# EAGLE schematic psu (EAGLE 9.6.2)
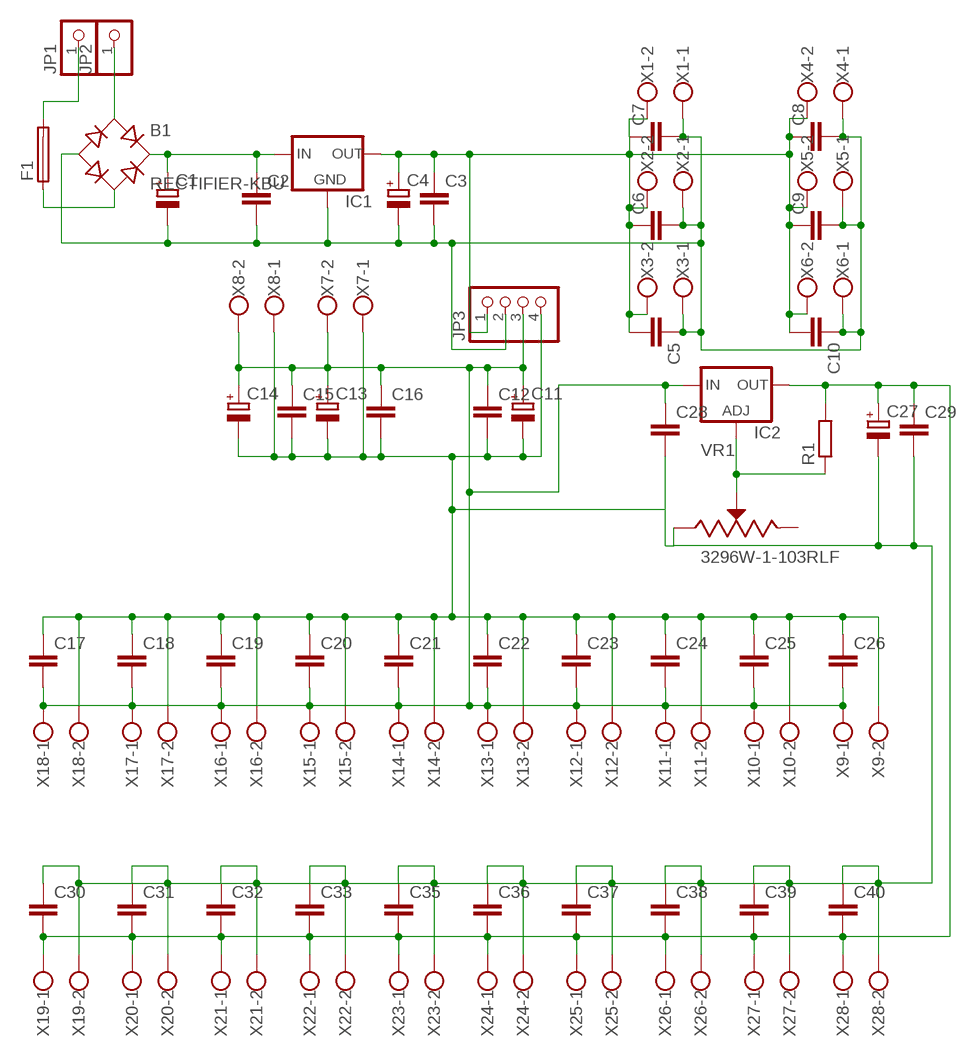
[diagram p0: schematic, sheet 1]

## Parts
B1  RECTIFIER-KBU  [KBU]
C1  CPOL-EUE7.5-18  [E7,5-18]
C2  C-EU025-025X050  [C025-025X050]
C3  C-EU025-025X050  [C025-025X050]
C4  CPOL-EUE5-10.5  [E5-10,5]
C5  C-EU025-025X050  [C025-025X050]
C6  C-EU025-025X050  [C025-025X050]
C7  C-EU025-025X050  [C025-025X050]
C8  C-EU025-025X050  [C025-025X050]
C9  C-EU025-025X050  [C025-025X050]
C10  C-EU025-025X050  [C025-025X050]
C11  CPOL-EUE5-10.5  [E5-10,5]
C12  C-EU025-025X050  [C025-025X050]
C13  CPOL-EUE2.5-6  [E2,5-6]
C14  CPOL-EUE2.5-6  [E2,5-6]
C15  C-EU025-025X050  [C025-025X050]
C16  C-EU025-025X050  [C025-025X050]
C17  C-EU025-025X050  [C025-025X050]
C18  C-EU025-025X050  [C025-025X050]
C19  C-EU025-025X050  [C025-025X050]
C20  C-EU025-025X050  [C025-025X050]
C21  C-EU025-025X050  [C025-025X050]
C22  C-EU025-025X050  [C025-025X050]
C23  C-EU025-025X050  [C025-025X050]
C24  C-EU025-025X050  [C025-025X050]
C25  C-EU025-025X050  [C025-025X050]
C26  C-EU025-025X050  [C025-025X050]
C27  CPOL-EUE2.5-6  [E2,5-6]
C28  C-EU025-025X050  [C025-025X050]
C29  C-EU025-025X050  [C025-025X050]
C30  C-EU025-025X050  [C025-025X050]
C31  C-EU025-025X050  [C025-025X050]
C32  C-EU025-025X050  [C025-025X050]
C33  C-EU025-025X050  [C025-025X050]
C35  C-EU025-025X050  [C025-025X050]
C36  C-EU025-025X050  [C025-025X050]
C37  C-EU025-025X050  [C025-025X050]
C38  C-EU025-025X050  [C025-025X050]
C39  C-EU025-025X050  [C025-025X050]
C40  C-EU025-025X050  [C025-025X050]
F1  SH22,5  [SH22,5]
IC1  78XXS  [78XXS]
IC2  LM317TS  [317TS]
JP1  PINHD-1X1  [1X01]
JP2  PINHD-1X1  [1X01]
JP3  PINHD-1X4  [1X04]
R1  R-EU_0204/7  [0204/7]
VR1  3296W-1-103RLF  [TRIM_3296W-1-103RLF]
X1  W237-102  [W237-102]
X2  W237-102  [W237-102]
X3  W237-102  [W237-102]
X4  W237-102  [W237-102]
X5  W237-102  [W237-102]
X6  W237-102  [W237-102]
X7  W237-102  [W237-102]
X8  W237-102  [W237-102]
X9  W237-102  [W237-102]
X10  W237-102  [W237-102]
X11  W237-102  [W237-102]
X12  W237-102  [W237-102]
X13  W237-102  [W237-102]
X14  W237-102  [W237-102]
X15  W237-102  [W237-102]
X16  W237-102  [W237-102]
X17  W237-102  [W237-102]
X18  W237-102  [W237-102]
X19  W237-102  [W237-102]
X20  W237-102  [W237-102]
X21  W237-102  [W237-102]
X22  W237-102  [W237-102]
X23  W237-102  [W237-102]
X24  W237-102  [W237-102]
X25  W237-102  [W237-102]
X26  W237-102  [W237-102]
X27  W237-102  [W237-102]
X28  W237-102  [W237-102]

## Nets
N$1: B1.AC1 JP2.1
N$2: F1.2 JP1.1
N$3: C11.+ C12.1 C13.+ C14.+ C15.1 C16.1 C17.2 C18.2 C19.2 C20.2 C21.2 C22.2 C23.2 C24.2 C25.2 C26.2 C28.1 IC2.3(IN) JP3.3 X7.2 X8.2 X9.1 X10.1 X11.1 X12.1 X13.1 X14.1 X15.1 X16.1 X17.1 X18.1
N$4: B1.+ C1.+ C2.1 IC1.IN
N$5: B1.AC2 F1.1
N$7: IC2.1(ADJ) R1.1 VR1.2(WIPER)
N$8: C11.- C12.2 C13.- C14.- C15.2 C16.2 C17.1 C18.1 C19.1 C20.1 C21.1 C22.1 C23.1 C24.1 C25.1 C26.1 C27.- C28.2 C29.2 C30.1 C31.1 C32.1 C33.1 C35.1 C36.1 C37.1 C38.1 C39.1 C40.1 JP3.4 VR1.1(CCW) X7.1 X8.1 X9.2 X10.2 X11.2 X12.2 X13.2 X14.2 X15.2 X16.2 X17.2 X18.2 X19.2 X20.2 X21.2 X22.2 X23.2 X24.2 X25.2 X26.2 X27.2 X28.2
N$10: C27.+ C29.1 C30.2 C31.2 C32.2 C33.2 C35.2 C36.2 C37.2 C38.2 C39.2 C40.2 IC2.2(OUT) R1.2 X19.1 X20.1 X21.1 X22.1 X23.1 X24.1 X25.1 X26.1 X27.1 X28.1
N$13: B1.- C1.- C2.2 C3.2 C4.- C5.1 C6.2 C7.2 C8.2 C9.2 C10.1 IC1.GND JP3.2 X1.1 X2.1 X3.1 X4.1 X5.1 X6.1
N$18: C3.1 C4.+ C5.2 C6.1 C7.1 C8.1 C9.1 C10.2 IC1.OUT JP3.1 X1.2 X2.2 X3.2 X4.2 X5.2 X6.2
Unconnected: VR1.3(CW)

## Library data of the parts
B1 = rectifier:RECTIFIER-: Rectifier
C1 C4 C11 C13 C14 C27 = rcl:CPOL-EU: POLARIZED CAPACITOR, European symbol; SPICEPREFIX: C
C2 C3 C5-C10 C12 C15-C26 C28-C33 C35-C40 = rcl:C-EU: CAPACITOR, European symbol; SPICEPREFIX: C
F1 = fuse:SH22,5: FUSE HOLDER grid 22,5 mm, OGN0031 8201, Schurter (Buerklin); MF: SCHURTER; MPN: 0031.8201; OC_FARNELL: 1162740; OC_NEWARK: 96F8317
IC1 = v-reg:78XXS: VOLTAGE REGULATOR
IC2 = v-reg:LM317TS: VOLTAGE REGULATOR
JP1 JP2 = pinhead:PINHD-1X1: PIN HEADER
JP3 = pinhead:PINHD-1X4: PIN HEADER
R1 = rcl:R-EU_: RESISTOR, European symbol; SPICEPREFIX: R
VR1 = 3296W-1-103RLF:3296W-1-103RLF: Check availability <https://pricing.snapeda.com/parts/3296W-1-103RLF/Bourns/view-part?ref=eda>; AVAILABILITY: In Stock; CHECK_PRICES: https://www.snapeda.com/parts/3296W-1-103RLF/Bourns/view-part/?ref=eda; DESCRIPTION: Trimmer, Cermet, Rest 10 Kilohms, PCB, 25 Turns, Pwr-Rtg 0.5W | Bourns 3296W-1-103RLF; MF: Bourns; MP: 3296W-1-103RLF; PACKAGE: NON STANDARD-3 Bourns; PRICE: None; PURCHASE-URL: https://www.snapeda.com/api/url_track_click_mouser/?unipart_id=480309&manufacturer=Bourns&part_name=3296W-1-103RLF&search_term=None; SNAPEDA_LINK: https://www.snapeda.com/parts/3296W-1-103RLF/Bourns/view-part/?ref=snap
X1-X28 = con-wago-500:W237-102: WAGO SCREW CLAMP; MPN: 237-102; OC_FARNELL: unknown; OC_NEWARK: 70K9898